# EasyEDA Pro project ProPrj_5V2A_2026-09-02.epro

# Schematic Schematic1
Board Name: Board1; Create Date: 2025-04-16
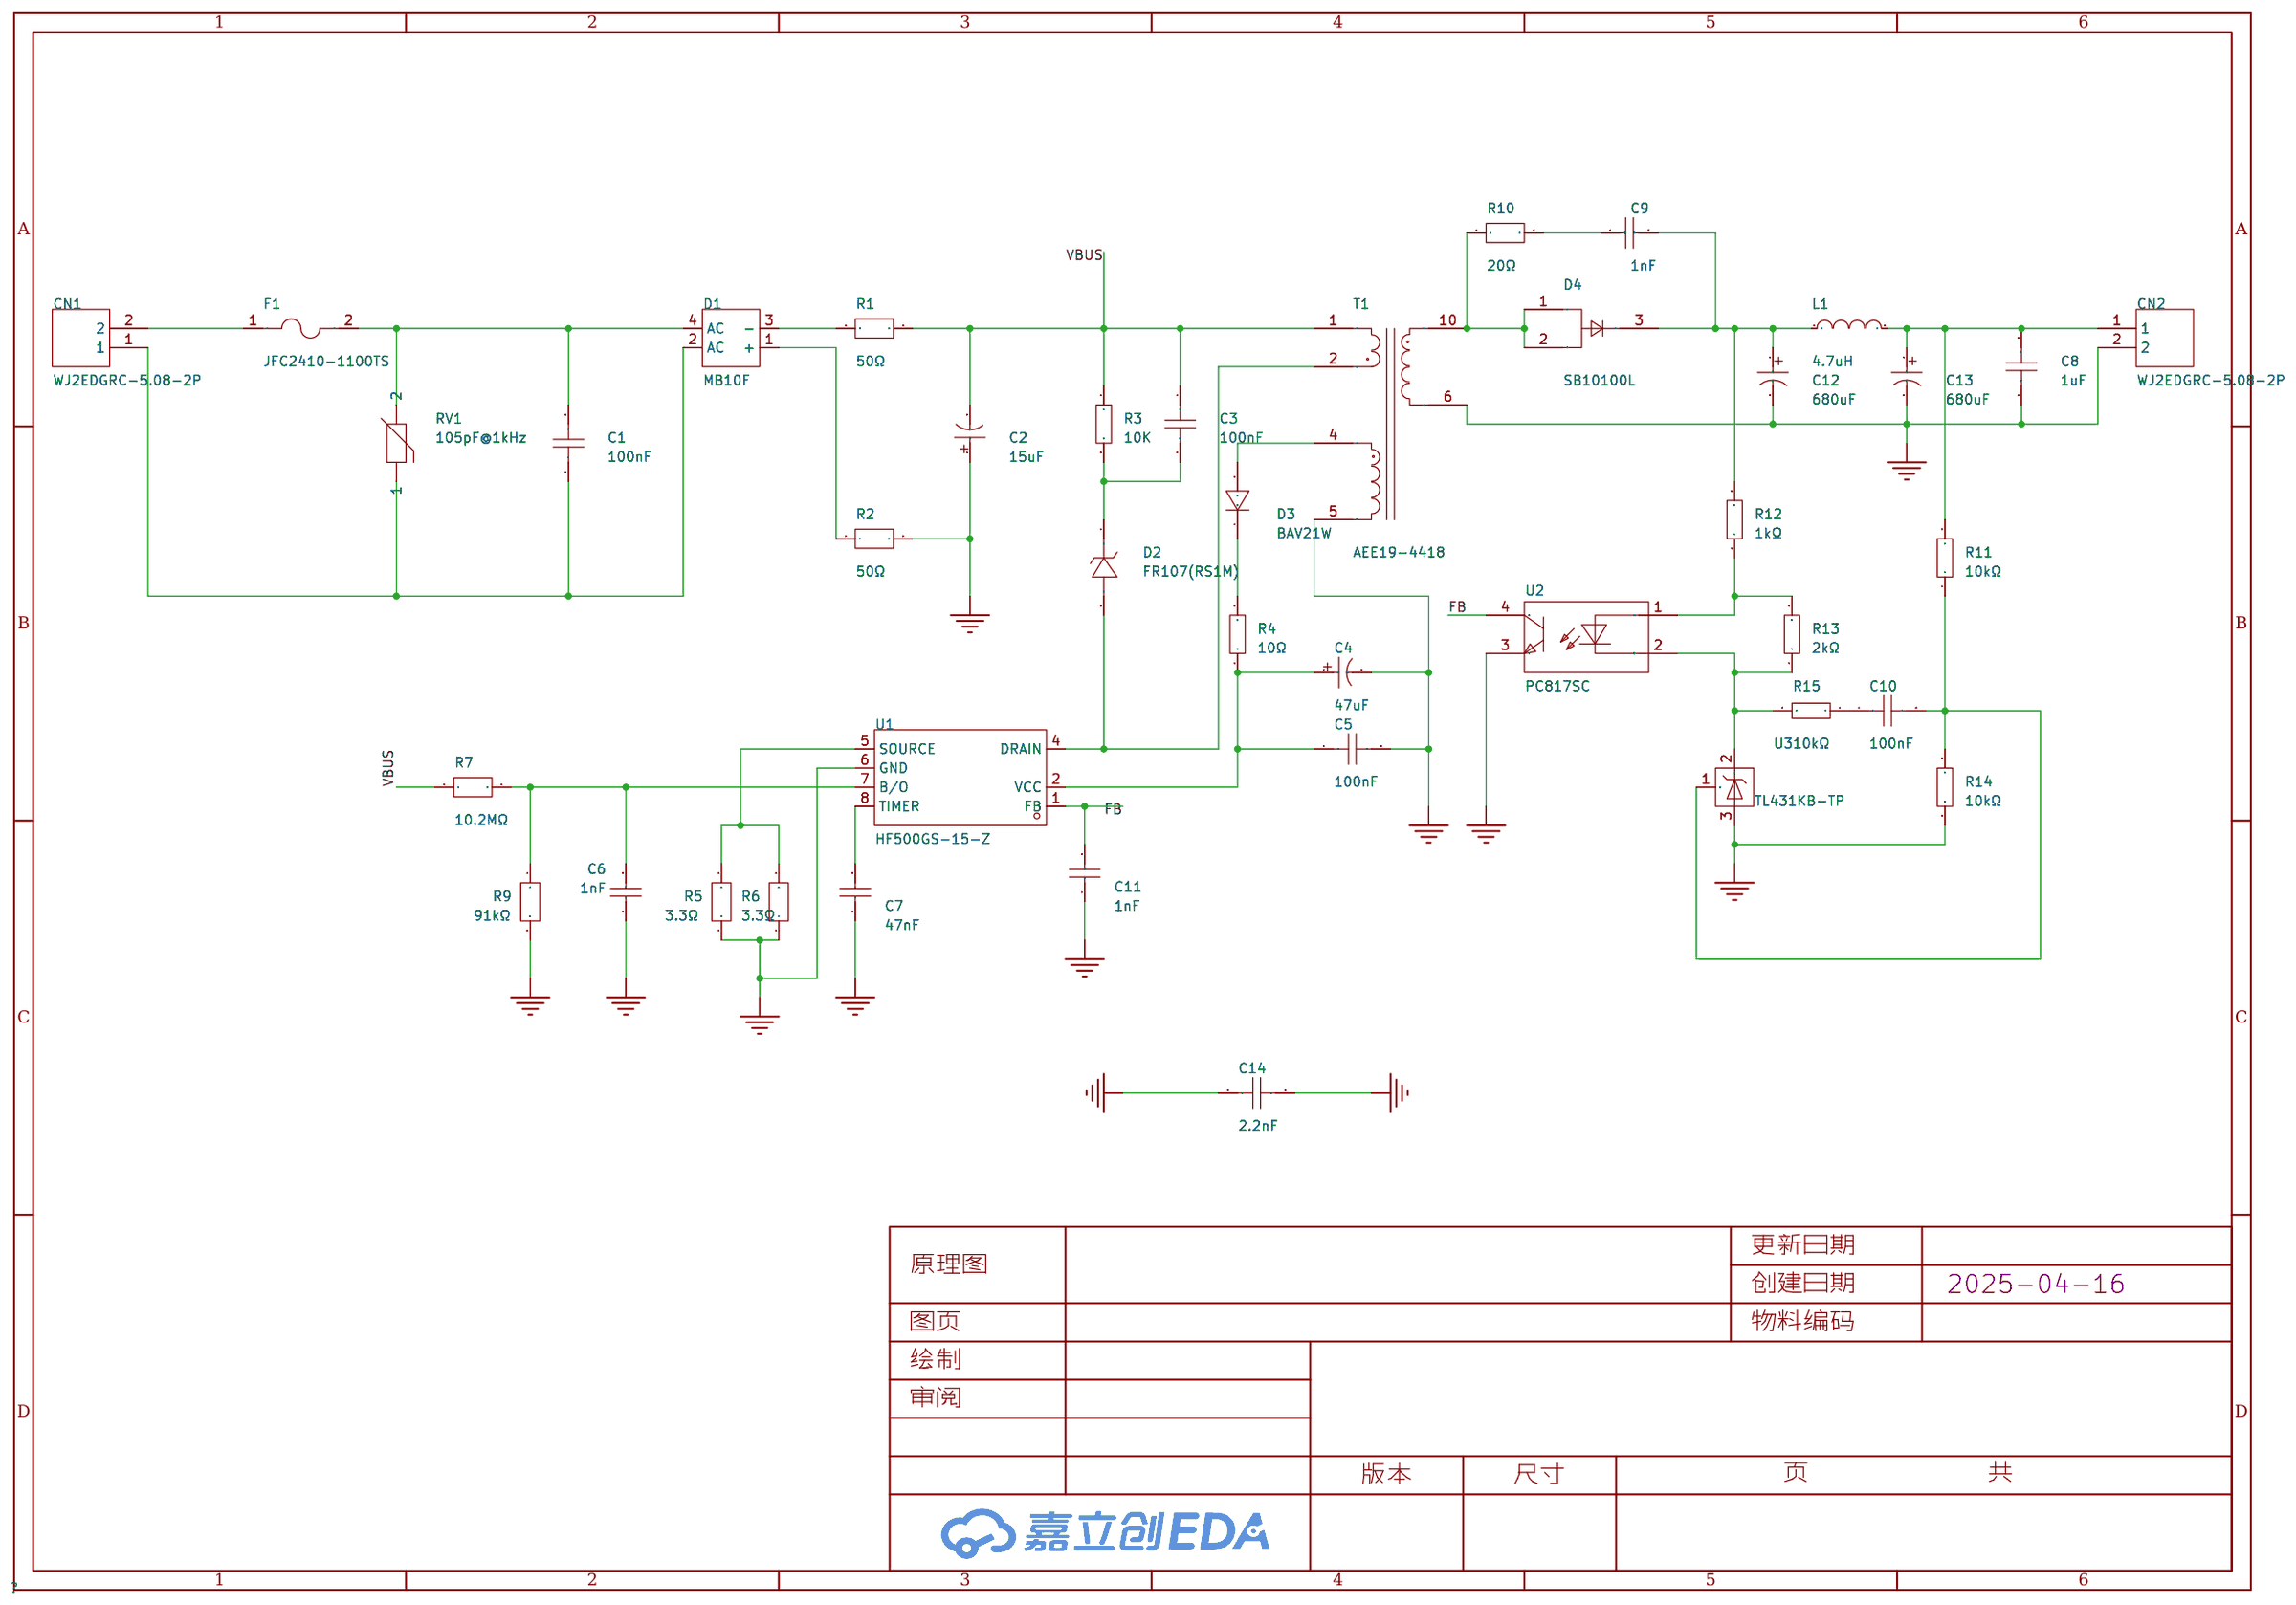
[diagram p0: schematic sheet]

## Parts
C1  100nF  [CAP-TH_L13.0-W6.0-P10.00-D0.6]
C2  15uF  [CAP-TH_BD10.0-P5.00-D1.0-FD]
C3  100nF  [C0603]
C4  47uF  [CAP-TH_BD6.3-P2.50-D1.0-FD]
C5  100nF  [C0603]
C6  1nF  [C1206]
C7  47nF  [C0603]
C8  1uF  [C0402]
C9  1nF  [C0603]
C10  100nF  [C0603]
C11  1nF  [C0603]
C12  680uF  [CAP-TH_BD8.0-P3.50-D0.6-FD]
C13  680uF  [CAP-TH_BD8.0-P3.50-D0.6-FD]
C14  2.2nF  [CAP-TH_L10.0-W4.5-P10.00-D0.6-S4.0]
CN1  WJ2EDGRC-5.08-2P  [CONN-TH_2P-P5.08_WJ2EDGRC-5.08-2P]
CN2  WJ2EDGRC-5.08-2P  [CONN-TH_2P-P5.08_WJ2EDGRC-5.08-2P]
D1  MB10F  [MBF_L4.8-W3.9-P2.50-LS6.7-TR]
D2  FR107(RS1M)  [SMA_L4.3-W2.6-LS5.2-RD]
D3  BAV21W  [SOD-123_L2.8-W1.8-LS3.7-RD]
D4  SB10100L  [TO-277A_L4.7-W6.1-LS6.6-TR]
F1  JFC2410-1100TS  [F2410]
L1  4.7uH  [IND-SMD_L7.0-W6.6]
R1  50Ω  [R1206]
R2  50Ω  [R1206]
R3  10K  [R0603]
R4  10Ω  [R0603]
R5  3.3Ω  [R1206]
R6  3.3Ω  [R1206]
R7  10.2MΩ  [R1206]
R9  91kΩ  [R0603]
R10  20Ω  [R0603]
R11  10kΩ  [R0603]
R12  1kΩ  [R0603]
R13  2kΩ  [R0603]
R14  10kΩ  [R0603]
R15  10kΩ  [R0603]
RV1  105pF@1kHz  [RES-TH_L9.0-W5.0-P6.00-D0.7-S3.00]
T1  AEE19-4418  [XFMR-TH_9P-L20.5-W16.9-P3.90-D0.7-S13.00_AEE19-4418]
U1  HF500GS-15-Z  [SOIC-8_7P-L4.9-W3.9-P1.27-LS6.0-BL-PE3]
U2  PC817SC  [SMD-4_L4.6-W6.5-P2.54-LS10.2-BL]
U3  TL431KB-TP  [SOT-23-3_L2.9-W1.4-P1.91-LS2.6-BR]

## Library data of the parts
C1 = MPX104K31C3KN15600: 容值:100nF;精度:±10%;工作电压(AC):275V；310V；305V;防护等级:X2;; LCSC Part Name: 100nF ±10% 275V 305V 310V 等级:X2; Supplier Part: C489079; Manufacturer: KNSCHA(科尼盛); Supplier Footprint: 插件,P=10mm; JLCPCB Part Class: 扩展库; Datasheet: https://atta.szlcsc.com/upload/public/pdf/source/20200225/C489079_75CB6A5338414DC85C4C6073302579B5.pdf; Supplier: LCSC; Tolerance: ±10%; Voltage(AC): 275V；310V；305V; Ratings: X2; safety certification: UL；CUL；KC；ENEC；VDE；CQC; Operating Temperature: -40℃~+110℃
C2 = KM156M400G17RR0VH2FP0: 容值:15uF;精度:±20%;额定电压:400V;纹波电流:-;等效串联电阻(ESR):-;; LCSC Part Name: 15uF ±20% 400V; Supplier Part: C5300; Manufacturer: CX(承兴); Supplier Footprint: 插件,D10xL17mm; JLCPCB Part Class: 扩展库; Datasheet: https://atta.szlcsc.com/upload/public/pdf/source/20211027/06D6BA3719C264B639DC286D935D03EA.pdf; Supplier: LCSC; Tolerance: ±20%; Voltage Rating: 400V; Pin Spacing: 5mm; Diameter: 10mm; Height - Seated (Max): 17mm; Lifetime: 2000hrs@105℃
C3 = CAP_0603: Supplier Footprint: 0603
C4 = KM476M050E11RR0VH2FP0: 容值:47uF;精度:±20%;额定电压:50V;; LCSC Part Name: 47uF ±20% 50V; Supplier Part: C45101; Manufacturer: CX(承兴); Supplier Footprint: 插件,D6.3xL11mm; JLCPCB Part Class: 扩展库; Datasheet: https://atta.szlcsc.com/upload/public/pdf/source/20230413/4F329AA96A66424FD3FF29340EA7427F.pdf; Supplier: LCSC; Tolerance: ±20%; Rated Voltage: 50V; Lead Spacing: 2.5mm; φD: 6.3mm; L: 11mm; Lifetime @ Temp: 1000hrs@105℃
C5 C10 = CGA0603X7R104K500JT: 容值:100nF;精度:±10%;额定电压:50V;温度系数:X7R;; LCSC Part Name: 100nF ±10% 50V; Supplier Part: C6119867; Manufacturer: HRE(芯声); Supplier Footprint: 0603; JLCPCB Part Class: 扩展库; Datasheet: https://atta.szlcsc.com/upload/public/pdf/source/20250103/C44077DA9E7B3EFAE02F22B6D3D1CBC9.pdf; Supplier: LCSC; Tolerance: ±10%; Voltage Rating: 50V; Temperature Coefficient: X7R
C6 = 1206B102K202NT: 容值:1nF;精度:±10%;额定电压:2kV;温度系数:X7R;; LCSC Part Name: 1nF ±10% 2kV; Supplier Part: C9196; Manufacturer: FH(风华); Supplier Footprint: 1206; JLCPCB Part Class: 基础库; Datasheet: https://atta.szlcsc.com/upload/public/pdf/source/20200305/C486355_26A10D38EF8C2A5C37091D0039909270.pdf; Supplier: LCSC; Tolerance: ±10%; Voltage Rating: 2kV; Temperature Coefficient: X7R
C7 = CL10B473KB8NNNC: 容值:47nF;精度:±10%;额定电压:50V;材质(温度系数):X7R;; LCSC Part Name: 47nF ±10% 50V; Supplier Part: C1622; Manufacturer: SAMSUNG(三星); Supplier Footprint: 0603; JLCPCB Part Class: 基础库; Datasheet: https://atta.szlcsc.com/upload/public/pdf/source/20160218/1457707763339.pdf; Supplier: LCSC; Tolerance: ±10%; Voltage Rated: 50V; Temperature Coefficient: X7R
C8 = CL05A105KA5NQNC: 容值:1uF;精度:±10%;额定电压:25V;材质(温度系数):X5R;; LCSC Part Name: 1uF ±10% 25V; Supplier Part: C52923; Manufacturer: SAMSUNG(三星); Supplier Footprint: 0402; JLCPCB Part Class: 基础库; Datasheet: https://atta.szlcsc.com/upload/public/pdf/source/20160218/1457707763339.pdf; Supplier: LCSC; Tolerance: ±10%; Voltage Rated: 25V; Temperature Coefficient: X5R
C9 = CC0603KRX7R9BB102: 容值:1nF;精度:±10%;额定电压:50V;材质(温度系数):X7R;; LCSC Part Name: 1nF ±10% 50V; Supplier Part: C100040; Manufacturer: YAGEO(国巨); Supplier Footprint: 0603; JLCPCB Part Class: 扩展库; Datasheet: https://atta.szlcsc.com/upload/public/pdf/source/20180910/C282072_33301C7F631E79921B82A8DAC6BCC5B3.pdf; Supplier: LCSC; Tolerance: ±10%; Voltage Rated: 50V; Temperature Coefficient: X7R
C11 = CL10B102KB8NNNC: 容值:1nF;精度:±10%;额定电压:50V;材质(温度系数):X7R;; LCSC Part Name: 1nF ±10% 50V; Supplier Part: C1588; Manufacturer: SAMSUNG(三星); Supplier Footprint: 0603; JLCPCB Part Class: 基础库; Datasheet: https://atta.szlcsc.com/upload/public/pdf/source/20160218/1457707763339.pdf; Supplier: LCSC; Tolerance: ±10%; Voltage Rated: 50V; Temperature Coefficient: X7R
C12 C13 = ULR687M1CF1ARR: 容值:680uF;精度:±20%;额定电压:16V;纹波电流:5.1A@100kHz;等效串联电阻(ESR):11mΩ@100kHz;类型:-;; LCSC Part Name: 680uF ±20% 16V; Supplier Part: C248458; Manufacturer: MAN YUE(万裕科技); Supplier Footprint: 插件,D8xL11.5mm; JLCPCB Part Class: 扩展库; Datasheet: https://atta.szlcsc.com/upload/public/pdf/source/20181106/C248463_8FFE85A6B0231DD342132C712786FADC.pdf; Supplier: LCSC; Tolerance: ±20%; Voltage Rating: 16V; Ripple Current: 5.1A@100kHz; Equivalent Series Resistance(ESR): 11mΩ@100kHz; Pin Spacing: 3.5mm; Diameter: 8mm; Height - Seated (Max): 11.5mm; Lifetime: 2000hrs@105℃; Operating Temperature: -55℃~+105℃
C14 = AJTF222M2GF0200A082E: 容值:2.2nF;精度:±20%;工作电压(AC):400V;防护等级:Y1;; LCSC Part Name: 2.2nF ±20% 400V 等级:Y1; Supplier Part: C2836435; Manufacturer: KNSCHA(科尼盛); Supplier Footprint: 插件,P=10mm; JLCPCB Part Class: 扩展库; Datasheet: https://atta.szlcsc.com/upload/public/pdf/source/20210528/C2836435_F925DEF82CD96F84221F2111C523A932.pdf; Supplier: LCSC; Tolerance: ±20%; Voltage(AC): 400V; Ratings: Y1; safety certification: UL；ENEC；VDE；CQC
CN1 CN2 = WJ2EDGRC-5.08-2P: 连接器类型:板端/插座-闭口;固定方式:-;结构:1x2P;间距:5.08mm;颜色:绿色;安装方式:弯针;排数:1;每排PIN数:2;额定电流:20A;额定电压:450V;线规 - AWG:-;线规 - 平方毫米:-;触头材质:黄铜;触头镀层:锡;工作温度范围:-40℃~+105℃;焊接温度(最大值):-;; LCSC Part Name: 1x2P 5.08mm 排数:1 每排P数:2; Supplier Part: C3697; Manufacturer: KANGNEX(康奈克斯电气); Supplier Footprint: 弯插,P=5.08mm; JLCPCB Part Class: 扩展库; Datasheet: https://atta.szlcsc.com/upload/public/pdf/source/20240813/4D8AF133EBD88DD18E5AA0CE5EC77AA3.pdf; Supplier: LCSC; Connector Type: 板端/插座-闭口; Structure: 1x2P; Pitch: 5.08mm; Color: 绿色; Mounting Style: 弯针; Number of Pins: 2P; Number of Rows: 1; Number of PINs Per Row: 2; Current Rating (Max): 20A; Voltage Rating (Max): 450V; Contact Material: 黄铜; Contact Plating: 锡; Operating Temperature Range: -40℃~+105℃
D1 = MB10F_C193012: 正向压降(Vf):1.1V@800mA;直流反向耐压(Vr):1kV;整流电流:800mA;正向浪涌电流(Ifsm):30A;; Supplier Part: C193012; Manufacturer: Hottech(合科泰); Supplier Footprint: MBF; JLCPCB Part Class: 扩展库; Datasheet: https://atta.szlcsc.com/upload/public/pdf/source/20220506/FD4075CDE73857D96FB1FF00CDC4C195.pdf; Supplier: LCSC; Voltage - Forward(Vf@If): 1.1V@800mA; Voltage - DC Reverse(Vr): 1kV; Current - Rectified: 800mA; Reverse Leakage Current (Ir): 5uA@1kV; Peak Forward Surge Current: 30A; Operating Temperature: -55℃~+150℃@(Tj)
D2 = FR107(RS1M): 二极管配置:独立式;正向压降(Vf):1.3V@1A;直流反向耐压(Vr):1kV;整流电流:1A;反向恢复时间(trr):500ns;; Supplier Part: C489136; Manufacturer: KEXIN(科信); Supplier Footprint: DO-214AC(SMA); JLCPCB Part Class: 扩展库; Datasheet: https://atta.szlcsc.com/upload/public/pdf/source/20200225/C489136_314C38B12EED29B9211A95D6A5FE7DCD.pdf; Supplier: LCSC; Diode Configuration: 独立式; Forward Voltage (Vf@If): 1.3V@1A; Reverse Voltage (Vr): 1kV; Rectified Current: 1A; Reverse Leakage Current (Ir): 5uA@1kV; Reverse Recovery Time (trr): 500ns
D3 = BAV21W_C21565: 二极管配置:独立式;正向压降(Vf):1.25V@200mA;直流反向耐压(Vr):200V;整流电流:200mA;反向恢复时间(trr):50ns;; LCSC Part Name: 丝印T3; Supplier Part: C21565; Manufacturer: CJ(江苏长电/长晶); Supplier Footprint: SOD-123; JLCPCB Part Class: 扩展库; Datasheet: https://atta.szlcsc.com/upload/public/pdf/source/20140301/1457707002435.pdf; Supplier: LCSC; Diode Configuration: 独立式; Forward Voltage (Vf@If): 1.25V@200mA; Reverse Voltage (Vr): 200V; Rectified Current: 200mA; Reverse Leakage Current (Ir): 100nA@200V; Reverse Recovery Time (trr): 50ns
D4 = SB10100L_C113946: 正向压降(Vf):850mV@10A;直流反向耐压(Vr):100V;整流电流:10A;; LCSC Part Name: 电压:100V 电流:10A; Supplier Part: C113946; Manufacturer: MDD(辰达半导体); Supplier Footprint: TO-277; JLCPCB Part Class: 扩展库; Datasheet: https://atta.szlcsc.com/upload/public/pdf/source/20240809/616B96B363601BCB19773D41304FDE7A.pdf; Supplier: LCSC; Forward Voltage (Vf@If): 850mV@10A; Reverse Voltage (Vr): 100V; Rectified Current: 10A; Reverse Leakage Current (Ir): 300uA@100V
F1 = JFC2410-1100TS: 类型:贴片式保险丝;额定电流:1A;额定电压 (AC):250V;额定电压:250V;分断能力:50A;; LCSC Part Name: 250V贴片式保险丝; Supplier Part: C136380; Manufacturer: JDTfuse(集电通); Supplier Footprint: SMD; JLCPCB Part Class: 扩展库; Datasheet: https://atta.szlcsc.com/upload/public/pdf/source/20230515/1D43BDD82FA89335B41B370141760CD9.pdf; Supplier: LCSC; Type: 贴片式保险丝; Current Rating: 1A; Voltage Rating (AC): 250V; Voltage Rating (DC): 250V; Operating Temperature: -55℃~+125℃; Interrupt Rating: 50A
L1 = FXL0630-4R7-M: 电感值:4.7uH;精度:±20%;额定电流:6A;饱和电流(Isat):9A;类型:一体成型电感;; LCSC Part Name: 4.7uH ±20% 9A; Supplier Part: C167220; Manufacturer: cjiang(长江微电); Supplier Footprint: SMD,6.6x7mm; JLCPCB Part Class: 扩展库; Datasheet: https://atta.szlcsc.com/upload/public/pdf/source/20240426/3189EA8206330E2108542F9E34E540E7.pdf; Supplier: LCSC; Tolerance: ±20%; Rated Current: 6A; Saturation Current (Isat): 9A; DC Resistance (DCR): 33mΩ; Type: 一体成型电感
R1 R2 = AR06FTBV0500: 电阻类型:薄膜电阻;阻值:50Ω;精度:±1%;功率:-;温度系数:±10ppm/℃;; LCSC Part Name: 薄膜电阻 50Ω ±1%; Supplier Part: C2984401; Manufacturer: Viking(光颉); Supplier Footprint: 1206; JLCPCB Part Class: 扩展库; Datasheet: https://atta.szlcsc.com/upload/public/pdf/source/20191129/C465721_10D49275DB41E427863CE9C8D788770A.pdf; Supplier: LCSC; Type: 薄膜电阻; Tolerance: ±1%; Temperature Coefficient: ±10ppm/℃
R3 = Res_0603: Supplier Footprint: 0603
R4 = 0603WAF100JT5E: 电阻类型:厚膜电阻;阻值:10Ω;精度:±1%;功率:100mW;最大工作电压:75V;温度系数:±400ppm/℃;; LCSC Part Name: 10Ω ±1% 100mW 厚膜电阻; Supplier Part: C22859; Manufacturer: UNI-ROYAL(厚声); Supplier Footprint: 0603; JLCPCB Part Class: 基础库; Datasheet: https://atta.szlcsc.com/upload/public/pdf/source/20200306/C422600_1E6D84923E4A46A82E41ADD87F860B5C.pdf; Supplier: LCSC; Type: 厚膜电阻; Tolerance: ±1%; Power(Watts): 100mW; Overload Voltage (Max): 75V; Temperature Coefficient: ±400ppm/℃; Operating Temperature Range: -55℃~+155℃
R5 R6 = FRC1206F3R30TS: 电阻类型:厚膜电阻;阻值:3.3Ω;精度:±1%;功率:250mW;最大工作电压:200V;温度系数:±200ppm/℃;; LCSC Part Name: 3.3Ω ±1% 250mW 厚膜电阻; Supplier Part: C2930397; Manufacturer: FOJAN(富捷); Supplier Footprint: 1206; JLCPCB Part Class: 扩展库; Datasheet: https://atta.szlcsc.com/upload/public/pdf/source/20211221/925EC7D7225764EE0046F22065062C87.pdf; Supplier: LCSC; Type: 厚膜电阻; Tolerance: ±1%; Power(Watts): 250mW; Overload Voltage (Max): 200V; Temperature Coefficient: ±200ppm/℃; Operating Temperature Range: -55℃~+155℃
R7 = 1206W4F1025T5E: 电阻类型:厚膜电阻;阻值:10.2MΩ;精度:±1%;功率:250mW;最大工作电压:200V;温度系数:±100ppm/℃;; LCSC Part Name: 10.2MΩ ±1% 250mW 厚膜电阻; Supplier Part: C422611; Manufacturer: UNI-ROYAL(厚声); Supplier Footprint: 1206; JLCPCB Part Class: 扩展库; Datasheet: https://atta.szlcsc.com/upload/public/pdf/source/20200306/C422600_1E6D84923E4A46A82E41ADD87F860B5C.pdf; Supplier: LCSC; Type: 厚膜电阻; Tolerance: ±1%; Power(Watts): 250mW; Overload Voltage (Max): 200V; Temperature Coefficient: ±100ppm/℃; Operating Temperature Range: -55℃~+155℃
R9 = FRC0603F9102TS: 电阻类型:厚膜电阻;阻值:91kΩ;精度:±1%;功率:100mW;工作电压:75V;温度系数:±100ppm/℃;; LCSC Part Name: 91kΩ ±1% 100mW 厚膜电阻; Supplier Part: C2907077; Manufacturer: FOJAN(富捷); Supplier Footprint: 0603; JLCPCB Part Class: 扩展库; Datasheet: https://atta.szlcsc.com/upload/public/pdf/source/20211221/925EC7D7225764EE0046F22065062C87.pdf; Supplier: LCSC; Type: 厚膜电阻; Tolerance: ±1%; Power(Watts): 100mW; Voltage-Supply(Max): 75V; Temperature Coefficient: ±100ppm/℃; Operating Temperature: -55℃~+155℃
R10 = FRC0603F20R0TS: 电阻类型:厚膜电阻;阻值:20Ω;精度:±1%;功率:100mW;工作电压:75V;温度系数:±100ppm/℃;; LCSC Part Name: 20Ω ±1% 100mW 厚膜电阻; Supplier Part: C2907012; Manufacturer: FOJAN(富捷); Supplier Footprint: 0603; JLCPCB Part Class: 扩展库; Datasheet: https://atta.szlcsc.com/upload/public/pdf/source/20211221/925EC7D7225764EE0046F22065062C87.pdf; Supplier: LCSC; Type: 厚膜电阻; Tolerance: ±1%; Power(Watts): 100mW; Voltage-Supply(Max): 75V; Temperature Coefficient: ±100ppm/℃; Operating Temperature: -55℃~+155℃
R11 R14 R15 = 0603WAF1002T5E: 电阻类型:厚膜电阻;阻值:10kΩ;精度:±1%;功率:100mW;最大工作电压:75V;温度系数:±100ppm/℃;; LCSC Part Name: 厚膜电阻 10kΩ ±1% 100mW; Supplier Part: C25804; Manufacturer: UNI-ROYAL(厚声); Supplier Footprint: 0603; JLCPCB Part Class: 基础库; Datasheet: https://atta.szlcsc.com/upload/public/pdf/source/20200306/C422600_1E6D84923E4A46A82E41ADD87F860B5C.pdf; Supplier: LCSC; Type: 厚膜电阻; Tolerance: ±1%; Power(Watts): 100mW; Overload Voltage (Max): 75V; Temperature Coefficient: ±100ppm/℃; Operating Temperature Range: -55℃~+155℃
R12 = 0603WAF1001T5E: 电阻类型:厚膜电阻;阻值:1kΩ;精度:±1%;功率:100mW;最大工作电压:75V;温度系数:±100ppm/℃;; LCSC Part Name: 1kΩ ±1% 100mW 厚膜电阻; Supplier Part: C21190; Manufacturer: UNI-ROYAL(厚声); Supplier Footprint: 0603; JLCPCB Part Class: 基础库; Datasheet: https://atta.szlcsc.com/upload/public/pdf/source/20200306/C422600_1E6D84923E4A46A82E41ADD87F860B5C.pdf; Supplier: LCSC; Type: 厚膜电阻; Tolerance: ±1%; Power(Watts): 100mW; Overload Voltage (Max): 75V; Temperature Coefficient: ±100ppm/℃; Operating Temperature Range: -55℃~+155℃
R13 = 0603WAF2001T5E: 电阻类型:厚膜电阻;阻值:2kΩ;精度:±1%;功率:100mW;最大工作电压:75V;温度系数:±100ppm/℃;; LCSC Part Name: 2kΩ ±1% 100mW 厚膜电阻; Supplier Part: C22975; Manufacturer: UNI-ROYAL(厚声); Supplier Footprint: 0603; JLCPCB Part Class: 基础库; Datasheet: https://atta.szlcsc.com/upload/public/pdf/source/20200306/C422600_1E6D84923E4A46A82E41ADD87F860B5C.pdf; Supplier: LCSC; Type: 厚膜电阻; Tolerance: ±1%; Power(Watts): 100mW; Overload Voltage (Max): 75V; Temperature Coefficient: ±100ppm/℃; Operating Temperature Range: -55℃~+155℃
RV1 = 07D471K: 压敏电压:423V~517V;钳位电压:810V;工作电压:385V;工作电压(AC):300V;; LCSC Part Name: 钳位电压810V 29焦耳 插件压敏电阻; Supplier Part: C317765; Manufacturer: COV(德欣); Supplier Footprint: 插件; JLCPCB Part Class: 扩展库; Datasheet: https://atta.szlcsc.com/upload/public/pdf/source/20201014/C317616_901970575376E76045DDED0C068F8E0D.pdf; Supplier: LCSC; Varistor Voltage: 423V~517V; Clamping Voltage: 810V; Maximum DC Volts: 385V; Maximum AC Volts: 300V; Peak Current: 1.2kA; Energy: 29J
T1 = AEE19-4418: 初级电压:-;; Supplier Part: C17540039; Manufacturer: Allied Components International; Supplier Footprint: 插件; JLCPCB Part Class: 扩展库; Supplier: LCSC; Isolation Voltage: 2.5kV
U1 = HF500GS-15-Z: 工作电压:12.5V~24V;开关频率:25kHz;晶体管耐压:700V;; Supplier Part: C17657021; Manufacturer: MPS(芯源); Supplier Footprint: SOIC-7; JLCPCB Part Class: 扩展库; Datasheet: https://atta.szlcsc.com/upload/public/pdf/source/20240129/526C548A996ED9C4FF96F6AA824E3F87.pdf; Supplier: LCSC; Output Isolation: 隔离; Supply Voltage: 12.5V~24V; Switching Frequency: 25kHz; Breakdown Voltage: 700V; Topology: 反激式; Operating Temperature: -40℃~+125℃@(TJ)
U2 = PC817SC_C490097: 可替代C115502; Supplier Part: C490097; Supplier Footprint: SMD; JLCPCB Part Class: 扩展库; Supplier: LCSC
U3 = TL431KB-TP: 输出类型:可编程;输入电压:-;输出电压:2.495V~36V;输出电流:100mA;精度:±0.4%;; Supplier Part: C3680135; Manufacturer: MCC(美微科); Supplier Footprint: SOT-23; JLCPCB Part Class: 扩展库; Supplier: LCSC; Output Type: 可编程; Output Voltage: 2.495V~36V; Output Current: 100mA; Tolerance: ±0.4%; Temperature Coefficient: 50ppm/℃; Reference Type: 并联; Operating Temperature: -40℃~+125℃

## Nets
GND: C2.1 C4.2 C5.2 C6.1 C7.1 C11.1 C14.1 R2.2 R5.1 R6.1 R9.2 T1.5 U1.6(GND) U2.3(EM)
GND1: C8.1 C12.2 C13.2 C14.2 CN2.2 R14.1 T1.6 U3.3(-)
VBUS: C2.2 C3.1 R1.2 R3.1 R7.2 T1.1
FB: C11.2 U1.1(FB) U2.4(COL)
$1N414: C1.2 D1.4(AC) F1.2 RV1.2
$1N1116: D1.3(-) R1.1
$1N1133: D1.1(+) R2.1
$1N1962: C3.2 D2.1(C) R3.2
$1N2753: D3.2(A) T1.4
$1N2758: D3.1(C) R4.2
$1N2821: C4.1 C5.1 R4.1 U1.2(VCC)
$1N2866: D2.2(A) T1.2 U1.4(DRAIN)
$1N3371: C6.2 R7.1 R9.1 U1.7(B/O)
$1N3382: R5.2 R6.2 U1.5(SOURCE)
$1N3536: C7.2 U1.8(TIMER)
$1N3901: D4.1 D4.2 R10.1 T1.10
$1N4099: C9.1 R10.2
$1N4484: R13.1 R15.2 U2.2(CAT) U3.2(+)
$1N4488: R12.1 R13.2 U2.1(AN)
$1N4693: C10.2 R11.1 R14.2 U3.1(REF)
$1N4778: C10.1 R15.1
$1N5983: C9.2 C12.1 D4.3 L1.1 R12.2
Net-(C1-1): C1.1 CN1.1 D1.2(AC) RV1.1
Net-(C8-2): C8.2 C13.1 CN2.1 L1.2 R11.2
Net-(CN1-2): CN1.2 F1.1

# Board PCB1
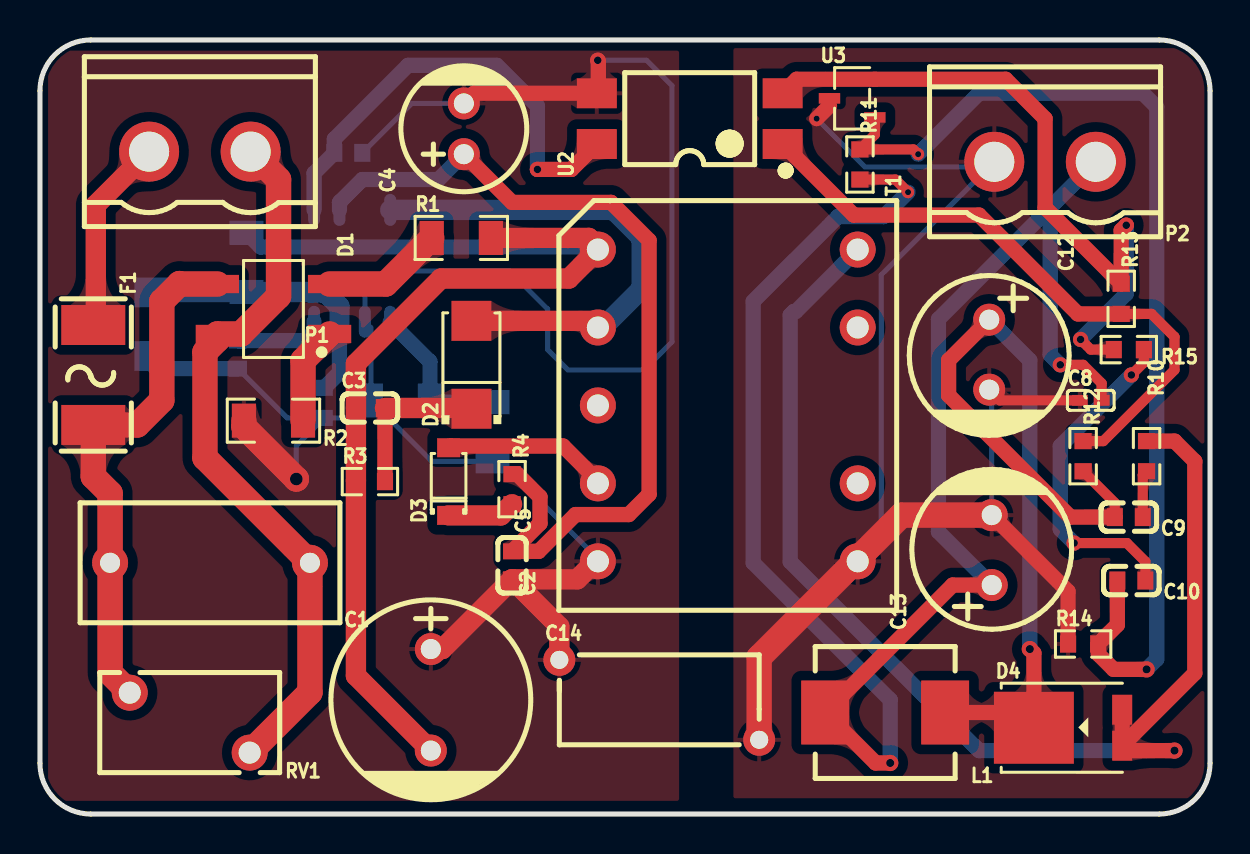
[diagram p1: board, top side]
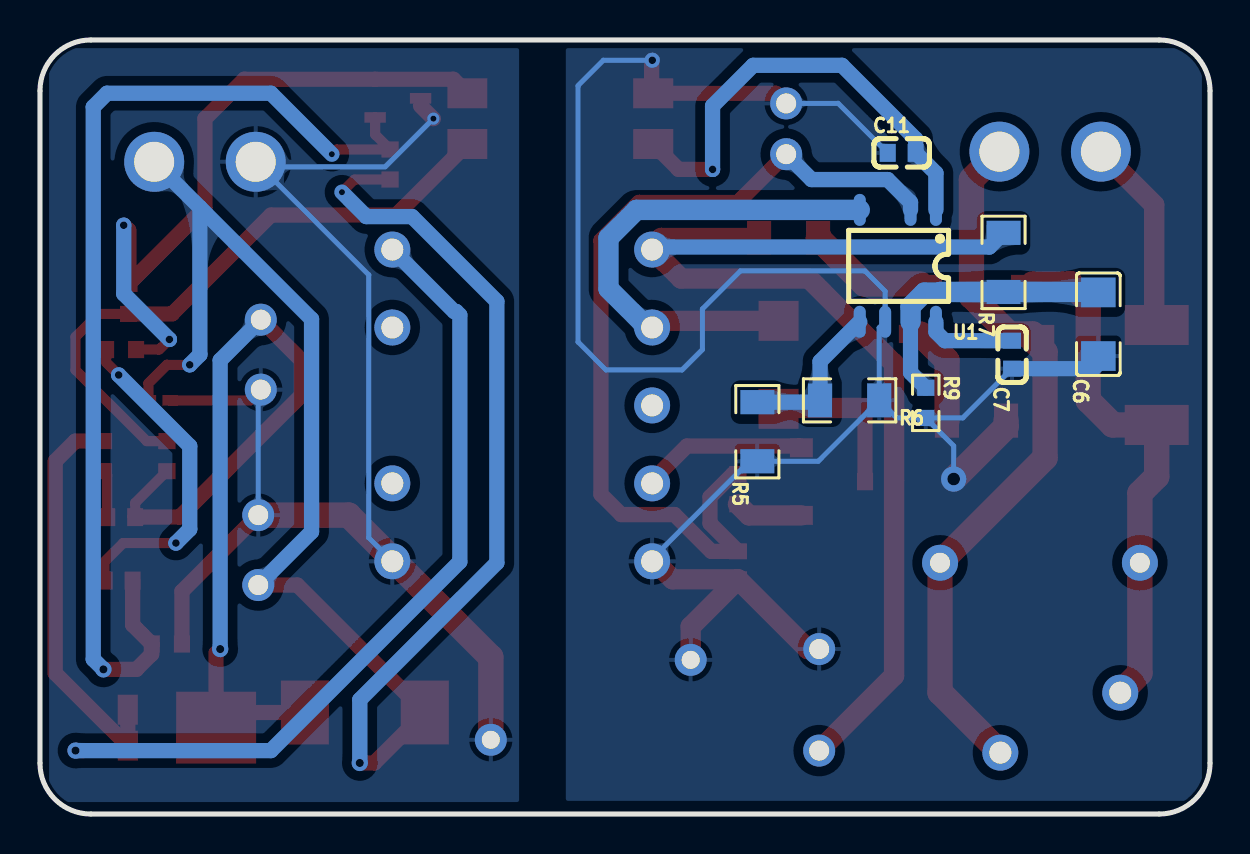
[diagram p2: board, bottom side, seen from below]

Outline 58.55 x 38.74 mm; copper layers: Top Layer, Bottom Layer. Coordinates in mm from the lower left corner of the outline.
Outline path: 0,36.2 0,2.54 arc(0.74,0.74) 2.54,0 56.01,0 arc(57.8,0.74) 58.55,2.54 58.55,36.2 arc(57.8,37.99) 56.01,38.74 2.54,38.74 arc(0.74,37.99) 0,36.2
Stack: Top Layer 0.035mm / Dielectric1 1.51mm FR4 er 4.5 / Bottom Layer 0.035mm

## Design rules (mm)
template: 自定义配置
spacing copperThickness1oz (default): track to track 0.102, other pairs 0.152 to 0.3
spacing copperThickness2oz: track to track 0.203, other pairs 0.152 to 0.3
track width copperThickness1oz (default): min 0.127, default 0.254, max 2.54
track width copperThickness2oz: min 0.203, default 0.254, max 2.54
differential pair differentialPair (default): width min 0.127, default 0.254, max 2.54; gap min 0.152, default 0.152
via viaSize (default): diameter min 0.5, default 0.61, max 10; hole min 0.3, default 0.305, max 6.299

## Placement (name value [footprint] x y rotation side)
C1  100nF  [CAP-TH_L13.0-W6.0-P10.00-D0.6]  8.51 12.57 180 top
C2  15uF  [CAP-TH_BD10.0-P5.00-D1.0-FD]  19.56 5.72 270 top
C3  100nF  [C0603]  16.51 20.32 0 top
C4  47uF  [CAP-TH_BD6.3-P2.50-D1.0-FD]  21.21 34.29 90 top
C5  100nF  [C0603]  23.62 12.45 270 top
C6  1nF  [C1206]  5.59 24.51 90 bottom
C7  47nF  [C0603]  9.91 22.99 90 bottom
C8  1uF  [C0402]  52.58 20.7 0 top
C9  1nF  [C0603]  54.48 14.86 180 top
C10  100nF  [C0603]  54.61 11.68 180 top
C11  1nF  [C0603]  15.43 33.09 180 bottom
C12  680uF  [CAP-TH_BD8.0-P3.50-D0.6-FD]  47.5 22.99 270 top
C13  680uF  [CAP-TH_BD8.0-P3.50-D0.6-FD]  47.63 13.21 90 top
C14  2.2nF  [CAP-TH_L10.0-W4.5-P10.00-D0.6-S4.0]  30.99 5.72 0 top
D1  MB10F  [MBF_L4.8-W3.9-P2.50-LS6.7-TR]  11.68 25.27 270 top
D2  FR107(RS1M)  [SMA_L4.3-W2.6-LS5.2-RD]  21.59 22.48 90 top
D3  BAV21W  [SOD-123_L2.8-W1.8-LS3.7-RD]  20.45 16.64 90 top
D4  SB10100L  [TO-277A_L4.7-W6.1-LS6.6-TR]  51.94 4.32 0 top
F1  JFC2410-1100TS  [F2410]  2.67 21.97 270 top
L1  4.7uH  [IND-SMD_L7.0-W6.6]  42.29 5.08 180 top
P1  88aeb08ab77f4966b8ab3ec6a470e6dd  [CONN-TH_2P-P5.08_DB2EVC-5.08-2P-BK]  8 33.15 180 top
P2  88aeb08ab77f4966b8ab3ec6a470e6dd  [CONN-TH_2P-P5.08_DB2EVC-5.08-2P-BK]  50.29 32.64 180 top
R1  50Ω  [R1206]  21.08 28.83 0 top
R2  50Ω  [R1206]  11.68 19.69 180 top
R3  10K  [R0603]  16.51 16.64 0 top
R4  10Ω  [R0603]  23.62 16.26 270 top
R5  3.3Ω  [R1206]  22.65 19.13 90 bottom
R6  3.3Ω  [R1206]  18.03 20.7 0 bottom
R7  10.2MΩ  [R1206]  10.33 27.6 90 bottom
R9  91kΩ  [R0603]  14.22 20.57 270 bottom
R10  20Ω  [R0603]  55.37 17.91 270 top
R11  10kΩ  [R0603]  41.03 32.5 270 top
R12  1kΩ  [R0603]  52.2 17.91 270 top
R13  2kΩ  [R0603]  54.1 25.78 270 top
R14  10kΩ  [R0603]  52.2 8.51 0 top
R15  10kΩ  [R0603]  54.48 23.24 180 top
RV1  105pF@1kHz  [RES-TH_L9.0-W5.0-P6.00-D0.7-S3.00]  7.49 4.57 180 top
T1  AEE19-4418  [XFMR-TH_9P-L20.5-W16.9-P3.90-D0.7-S13.00_AEE19-4418]  34.42 20.45 270 top
U1  HF500GS-15-Z  [SOIC-8_7P-L4.9-W3.9-P1.27-LS6.0-BL-PE3]  15.62 27.43 0 bottom
U2  PC817SC  [SMD-4_L4.6-W6.5-P2.54-LS10.2-BL]  32.51 34.8 90 top
U3  TL431KB-TP  [SOT-23-3_L2.9-W1.4-P1.91-LS2.6-BR]  40.64 35.81 0 top

## Footprints (pads in the part's own frame, mm; a bottom-side part is the same pattern mirrored in y, then rotated)
C0402
  rect 0.79x0.54 smd: 1(-0.545,0) 2(0.545,0)
C0603
  rect 0.8x0.9 smd: 1(-0.7,0) 2(0.7,0)
C1206
  rect 1.485x1.728 smd: 1(-1.593,0) 2(1.593,0)
CAP-TH_BD6.3-P2.50-D1.0-FD
  round 1.6 hole 1: 1(-1.27,0) 2(1.27,0)
CAP-TH_BD8.0-P3.50-D0.6-FD
  round 1.6 hole 1: 1(-1.75,0) 2(1.75,0)
CAP-TH_BD10.0-P5.00-D1.0-FD
  round 1.6 hole 1: 1(-2.54,0) 2(2.54,0)
CAP-TH_L10.0-W4.5-P10.00-D0.6-S4.0
  round 1.6 hole 0.9: 1(-5,2) 2(5,-2)
CAP-TH_L13.0-W6.0-P10.00-D0.6
  round 1.8 hole 1: 1(-5,0) 2(5,0)
CONN-TH_2P-P5.08_DB2EVC-5.08-2P-BK
  round 3 hole 2: 1(-2.54,0) 2(2.54,0)
F2410
  rect 2x3.2 smd: 1(-2.5,0) 2(2.5,0)
IND-SMD_L7.0-W6.6
  rect 2.4x3.2 smd: 1(-3,0) 2(3,0)
MBF_L4.8-W3.9-P2.50-LS6.7-TR
  rect 0.91x2.165 smd: 1(1.25,2.808) 2(1.25,-2.808) 3(-1.25,2.808) 4(-1.25,-2.808)
R0603
  rect 0.806x0.864 smd: 1(-0.753,0) 2(0.753,0)
R1206
  rect 1.208x1.701 smd: 1(-1.479,0) 2(1.479,0)
RES-TH_L9.0-W5.0-P6.00-D0.7-S3.00
  round 1.8 hole 1.1: 1(-3,1.5) 2(3,-1.5)
SMA_L4.3-W2.6-LS5.2-RD
  rect 2x2 smd: 1(-2.2,0) 2(2.2,0)
SMD-4_L4.6-W6.5-P2.54-LS10.2-BL
  rect 1.5x2 smd: 1(-1.27,-4.65) 2(1.27,-4.65) 3(1.27,4.65) 4(-1.27,4.65)
SOD-123_L2.8-W1.8-LS3.7-RD
  rect 0.95x1.15 smd: 1(-1.692,0) 2(1.692,0)
SOIC-8_7P-L4.9-W3.9-P1.27-LS6.0-BL-PE3
  oval 0.6x1.6 smd: 1(-1.905,-2.8) 2(-0.635,-2.8) 4(1.905,-2.8) 5(1.905,2.8) 6(0.635,2.8) 7(-0.635,2.8) 8(-1.905,2.8)
SOT-23-3_L2.9-W1.4-P1.91-LS2.6-BR
  rect 1.07x0.532 smd: 1(1.135,-0.955) 2(1.135,0.955) 3(-1.135,0)
TO-277A_L4.7-W6.1-LS6.6-TR
  rect 1x1.5 smd: 1(2.21,0.9) 2(2.21,-0.9)
  rect 4x3.6 smd: 3(-2.21,0)
XFMR-TH_9P-L20.5-W16.9-P3.90-D0.7-S13.00_AEE19-4418
  round 1.8 hole 1.1: 1(-7.8,-6.5) 2(-3.9,-6.5) 3(0,-6.5) 4(3.9,-6.5) 5(7.8,-6.5) 6(7.8,6.5) 7(3.9,6.5) 9(-3.9,6.5) 10(-7.8,6.5)

## Nets
As in the schematic, except:
GND1: C8.1 C12.2 C13.2 C14.2 P2.2 R14.1 T1.6 U3.3
$1N409: F1.1 P1.2
$1N902: C1.1 D1.2 P1.1 RV1.1
$1N5975: C8.2 C13.1 L1.2 P2.1 R11.2

Pads without a net: T1 3 7 9

## Via types
v1: diameter 1.27, hole 0.635, Top Layer to Bottom Layer, 1 via
v2: diameter 0.762, hole 0.381, Top Layer to Bottom Layer, 7 vias
v3: diameter 0.813, hole 0.406, Top Layer to Bottom Layer, 4 vias
v4: diameter 0.61, hole 0.305, Top Layer to Bottom Layer, 3 vias

## Routing (per net, layer and track width the routed paths; a pad name or vN(x,y) marks a point on that pad's centre or on a via; arc(x,y) is an arc through that point)
GND: length 107
  Top Layer w0.762: v2(27.91,37.72) 27.94,37.69 27.94,36.15 27.86,36.07 21.72,36.07 C4.2
  Top Layer w1.016: C2.1 20.13,8.26 C5.2 ; C14.1 25.99,9.38 C5.2 ; C5.2 26.89,11.75 27.92,12.77
  Top Layer w1.27: v1(12.83,16.76) 10.2,19.39 10.2,19.69
  Bottom Layer w0.254: C7.1 12.37,19.82 R9.2 ; R6.1 16.55,24.33 U1.6 16.26,26.16 17.27,27.18 23.5,27.18 25.4,25.27 25.4,23.24 26.42,22.23 30.23,22.23 31.62,23.62 31.62,36.45 30.35,37.72 v2(27.91,37.72) ; R6.1 15.67,19.82 R9.2 ; R6.1 19.6,17.65 R5.1 23.04,17.65 27.92,12.77 ; C4.2 18.6,35.56 C11.1 ; R9.2 12.83,18.42 v1(12.83,16.76)
  Bottom Layer w0.762: 5.52,22.6 5.83,22.29 C7.1
GND1: length 71.4
  Top Layer w0.508: 52.03,20.7 48.03,20.7 C12.2 ; U3.3 39.51,35.44
  Top Layer w0.762: C13.2 51.44,11.14 R14.1 ; 39.51,35.44 v4(38.86,34.8)
  Top Layer w1.27: C14.2 35.99,7.85 43.1,14.96 C13.2
  Bottom Layer w0.254: T1.6 42.1,13.83 42.1,26.98 47.24,32.13 ; 47.24,32.13 P2.2 ; 47.24,32.13 46.99,32.39 41.27,32.39 v4(38.86,34.8) ; C13.2 47.63,21.11 C12.2
VBUS: length 58.9
  Top Layer w0.254: R3.1 15.81,16.69
  Top Layer w1.016: C2.2 15.81,6.92 C3.1 15.81,22.54 20.07,26.8 26.47,26.8 T1.1 ; 27.92,28.37 27.46,28.83 22.56,28.83
  Bottom Layer w0.762: R7.2 11.04,28.37 27.92,28.37
FB: length 23.2
  Top Layer w0.762: v2(24.89,32.26) 26.59,32.26 U2.4
  Bottom Layer w0.762: v2(24.89,32.26) 24.89,35.43 22.86,37.47 18.42,37.47 14.73,33.78 14.73,33.09 13.72,32.07 13.72,30.23
$1N409: length 10
  Top Layer w1.016: 2.79,24.22 2.79,30.48 P1.2
$1N414: length 26.2
  Top Layer w1.27: D1.4 7.01,26.52 6.98,26.54 6.1,25.65 6.1,20.7 4.87,19.47 F1.2 2.67,16.89 3.51,16.05 C1.2 3.51,7.06 RV1.2
$1N902: length 36.3
  Top Layer w1.27: RV1.1 13.51,6.09 C1.1 8.26,17.83 8.26,23.11 8.88,23.74 D1.2 10.05,24.02 11.94,25.91 11.94,31.75 P1.1
$1N1116: length 6.1
  Top Layer w1.27: D1.3 17.3,26.52 R1.1
$1N1133: length 4.9
  Top Layer w1.27: D1.1 13.16,22.69 13.16,19.69
$1N1962: length 8.1
  Top Layer w0.254: C3.2 17.26,20.32
  Top Layer w0.762: R3.2 17.26,20.32
  Top Layer w1.016: 17.26,20.32 21.55,20.32 D2.1
$1N2753: length 8.2
  Top Layer w0.762: 27.92,16.67 26.18,18.42 20.53,18.42 D3.2
$1N2758: length 3.4
  Top Layer w1.016: R4.2 23.06,14.94 D3.1
$1N2821: length 44.6
  Top Layer w0.762: C4.1 23.62,30.61 28.58,30.61 30.48,28.7 30.48,16 29.46,14.99 26.8,14.99 24.96,13.15 23.62,13.15 25.02,14.54 25.02,15.87 23.88,17.01 R4.1
  Bottom Layer w0.762: C4.1 19.94,31.75 16.13,31.75 14.99,30.61 14.99,30.23
$1N2866: length 25
  Top Layer w1.016: D2.2 27.71,24.68 27.92,24.47
  Bottom Layer w1.016: 27.92,24.47 28.28,24.47 30.1,26.29 30.1,28.83 28.7,30.23 17.53,30.23
$1N3371: length 14.1
  Bottom Layer w0.762: U1.7 14.99,22.09 R9.1
  Bottom Layer w1.016: U1.7 14.99,25.4 14.29,26.09 13.53,26.09 13.49,26.13 R7.1 5.86,26.13 5.84,26.1 C6.2
$1N3382: length 7.9
  Bottom Layer w0.762: R5.2 19.6,20.61 19.51,20.7 19.51,22.65 U1.5
$1N3536: length 4.5
  Bottom Layer w0.762: U1.8 13.72,24.13 13.27,23.69 C7.2
$1N3901: length 63.3
  Top Layer w0.762: v3(56.77,3.18) 54.4,3.18 D4.2 ; D4.2 57.79,7.05 57.79,17.65 56.78,18.66 R10.1 ; D4.2 54.15,5.22
  Bottom Layer w0.762: v3(56.77,3.18) 46.99,3.18 37.54,12.63 37.54,24.97 37.72,25.15 37.82,25.15 T1.10
$1N4099: length 2.5
  Top Layer w0.508: R10.2 55.18,16.96 55.18,14.73
$1N4484: length 35.5
  Top Layer w0.508: R15.2 52.58,23.24 v2(52.07,23.75)
  Top Layer w0.762: v2(54.36,29.46) 54.1,29.21 54.1,26.67 ; 37.16,36.07 37.86,36.77 U3.2 48.32,36.77 50.29,34.8 50.29,30.34 R13.1
  Bottom Layer w0.762: v2(54.36,29.46) 54.36,26.04 v2(52.07,23.75)
$1N4488: length 31.3
  Top Layer w0.508: R13.2 55.62,25.03 56.77,23.88 56.77,22.23 53.2,18.66 R12.1
  Top Layer w0.762: R13.2 51.93,25.03 46.99,29.97 40.72,29.97 U2.1
$1N4693: length 53.6
  Top Layer w0.508: U3.1 41.77,34 R11.1 43.71,33.26 v4(43.94,33.02)
  Top Layer w0.762: C10.2 53.91,9.47 R14.2 52.96,8.5 52.96,8 53.72,7.24 v3(55.37,7.24)
  Bottom Layer w0.762: v3(55.37,7.24) 55.88,7.75 55.88,35.38 55.19,36.07 46.99,36.07 v4(43.94,33.02)
$1N4778: length 16.6
  Top Layer w0.508: C10.1 55.31,12.64 54.39,13.56 v2(51.74,13.56) ; R15.1 55.24,22.6 v2(54.61,21.97)
  Bottom Layer w0.762: v2(51.74,13.56) 51.05,14.25 51.05,18.42 v2(54.61,21.97)
$1N5975: length 90.8
  Top Layer w0.508: R11.2 42.81,31.75 v4(43.44,31.12) ; v2(51.05,22.48) 52.2,22.48 53.12,21.55 C8.2
  Top Layer w0.762: v3(42.55,2.56) 41.82,2.56 L1.2 45.67,11.46 C13.1
  Bottom Layer w0.762: 50.55,30.35 50.55,22.99 v2(51.05,22.48) ; 50.55,30.35 44.96,24.77 44.96,14.12 C13.1 ; 50.55,30.35 P2.1 ; v4(43.44,31.12) 42.22,29.9 39.93,29.9 35.69,25.65 35.69,12.57 42.55,5.72 v3(42.55,2.56)
$1N5983: length 44.5
  Top Layer w0.508: 53.78,14.99 53.78,15.57 R12.2
  Top Layer w0.762: v3(49.53,8.26) 49.73,8.05 D4.3 48.97,5.08 L1.1 ; C12.1 45.47,22.71 45.47,20.96 51.56,14.86 C9.2 53.78,14.99
  Bottom Layer w0.762: v3(49.53,8.26) 49.53,22.71 C12.1

## Copper pours and planes (outline as drawn; the poured copper is in the pictures)
GND on Top Layer: 0.38,38.23 32,38.23 32,0.64 0.38,0.64
GND on Bottom Layer: 0.38,38.35 32.26,38.35 32.26,0.64 0.38,0.64
GND1 on Top Layer: 34.67,38.35 58.29,38.35 58.29,0.76 34.67,0.76
GND1 on Bottom Layer: 34.54,38.35 58.12,38.35 58.12,0.57 34.54,0.57
$1N3371 on Bottom Layer: 6.45,26.85 7.98,26.85 7.98,25.36 6.45,25.36

Small or netless copper shapes (teardrops, artwork), in the pictures only: 90 on Top Layer, 46 on Bottom Layer
